# Altium schematic sheet Airspeed_Connector.SchDoc
size A4
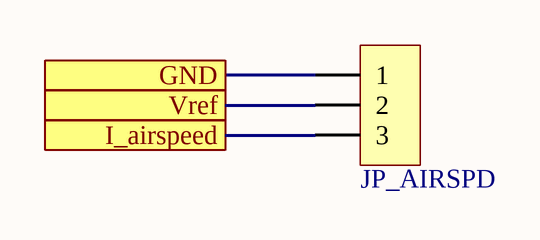
[diagram p0: Airspeed_Connector.SchDoc]

## Parts
JP_AIRSPD  HDR-1X3  [HDR2.54-WI-3P]  (value not drawn)

## Ports
GND, I_airspeed, Vref

## Nets
GND: JP_AIRSPD.1 ; port GND
I_airspeed: JP_AIRSPD.3 ; port I_airspeed
Vref: JP_AIRSPD.2 ; port Vref

## Library data of the parts
JP_AIRSPD = Header 3: 3P接插件; 版权归属: 源创客; BOM名称: 3P接插件; 学习资源: www.ooocke.com